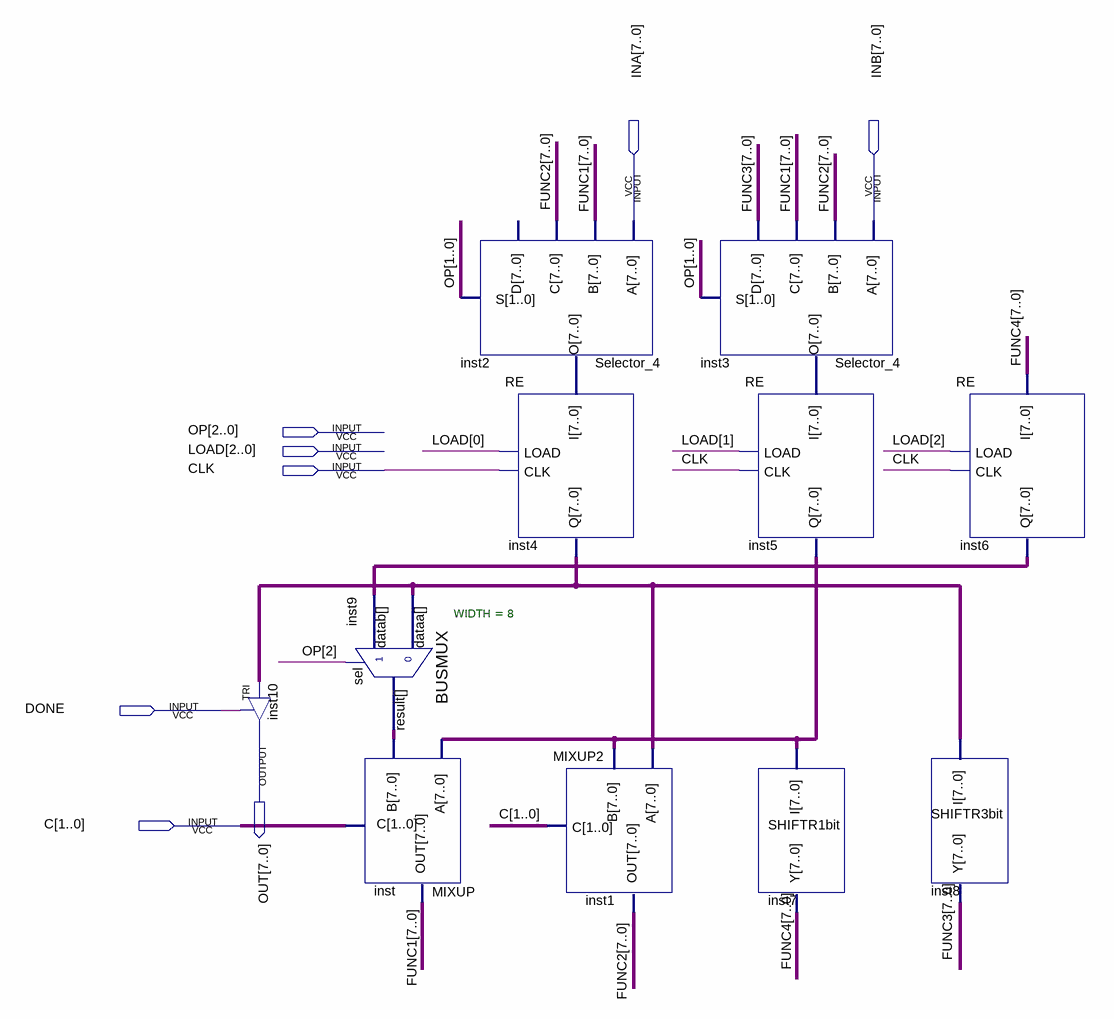
[diagram p0: schematic sheet]
// Quartus schematic DATAPATH.bdf as structural Verilog: 11 symbols, 8 pins
module DATAPATH (
  input  [7:0] INA,
  input  [7:0] INB,
  input  [2:0] OP,
  input  [2:0] LOAD,
  input  CLK,
  input  DONE,
  input  [1:0] C,
  output [7:0] OUT
);

  wire [7:0] FUNC1, FUNC2, FUNC3, FUNC4, inst2_o, inst3_o, inst4_q, inst5_q, inst6_q, inst9_result;

  TRI inst10[7:0] (.IN(inst4_q), .OE(DONE), .OUT(OUT));
  BUSMUX #(.WIDTH(8)) inst9 (.datab(inst6_q), .sel(OP[2]), .dataa(inst4_q), .result(inst9_result));
  MIXUP inst (.A(inst5_q), .B(inst9_result), .C(C), .OUT(FUNC1));
  Selector_4 inst2 (.A(INA), .B(FUNC1), .C(FUNC2), .S(OP[1:0]), .O(inst2_o));  // open: D
  RE inst4 (.I(inst2_o), .LOAD(LOAD[0]), .CLK(CLK), .Q(inst4_q));
  MIXUP2 inst1 (.A(inst4_q), .B(inst5_q), .C(C), .OUT(FUNC2));
  Selector_4 inst3 (.A(INB), .B(FUNC2), .C(FUNC1), .D(FUNC3), .S(OP[1:0]), .O(inst3_o));
  RE inst5 (.I(inst3_o), .LOAD(LOAD[1]), .CLK(CLK), .Q(inst5_q));
  SHIFTR1bit inst7 (.I(inst5_q), .Y(FUNC4));
  RE inst6 (.I(FUNC4), .LOAD(LOAD[2]), .CLK(CLK), .Q(inst6_q));
  SHIFTR3bit inst8 (.I(inst4_q), .Y(FUNC3));
endmodule
